# Altium schematic sheet power.SchDoc
size A4
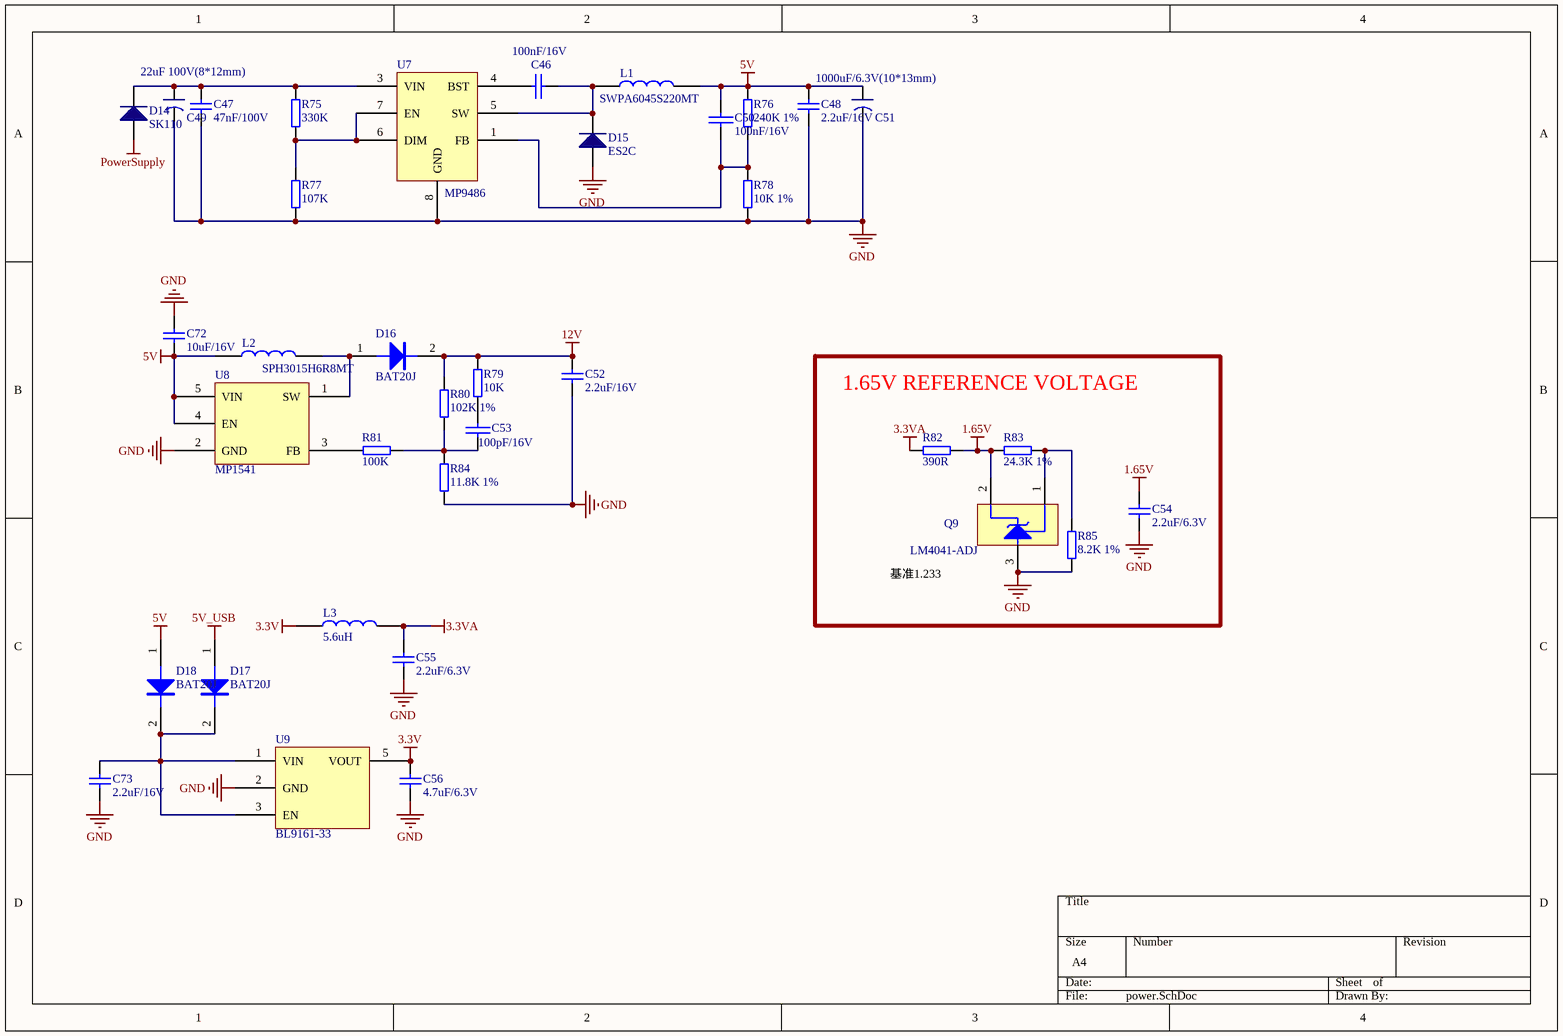
[diagram p0: power.SchDoc]

## Parts
C46  100nF/16V  [C0402]
C47  47nF/100V  [C1206]
C48  2.2uF/16V  [C0603]
C49  22uF 100V(8*12mm)  [AL-ELEC 8*12mm]
C50  100nF/16V  [C0402]
C51  1000uF/6.3V(10*13mm)  [AL-ELEC 10*13mm]
C52  2.2uF/16V  [C0603]
C53  100pF/16V  [C0402]
C54  2.2uF/6.3V  [C0402]
C55  2.2uF/6.3V  [C0402]
C56  4.7uF/6.3V  [C0603]
C72  10uF/16V  [C0805]
C73  2.2uF/16V  [C0603]
D14  SK110  [DO-214AC SMA]
D15  ES2C  [DO-214AA SMB]
D16  BAT20J  [SOD-323]
D17  BAT20J  [SOD-323]
D18  BAT20J  [SOD-323]
L1  SWPA6045S220MT  [SWPA6045S]
L2  SPH3015H6R8MT  [SPH3015]
L3  5.6uH  [L0402]
Q9  LM4041-ADJ  [SOT-23]
R75  330K  [R0402]
R76  240K 1%  [R0402]
R77  107K  [R0402]
R78  10K 1%  [R0402]
R79  10K  [R0402]
R80  102K 1%  [R0402]
R81  100K  [R0402]
R82  390R  [R0603]
R83  24.3K 1%  [R0402]
R84  11.8K 1%  [R0402]
R85  8.2K 1%  [R0402]
U7  MP9486  [SOIC-8 EP]
U8  MP1541  [SOT-23(5)]
U9  BL9161-33  [SOT-23(5)]

## Blocks framed on the sheet
1.65V REFERENCE VOLTAGE: C54 Q9 R82 R83 R85

## Nets
1.65V: C54.2 Q9.2 R82.2 R83.1
3.3V: C56.2 L3.1 U9.5(VOUT)
3.3VA: C55.2 L3.2 R82.1
5V: C48.2 C50.1 C51.1 C72.1 D18.1(A) L1.2 L2.1 R76.1 U8.4(EN) U8.5(VIN)
5V_USB: D17.1(A)
12V: C52.2 D16.2(K) R79.1 R80.1
GND: C47.1 C48.1 C49.2 C51.2 C52.1 C54.1 C55.1 C56.1 C72.2 C73.1 D15.1 Q9.3 R77.2 R78.2 R84.2 R85.2 U7.8(GND) U8.2(GND) U9.2(GND)
PowerSupply: D14.1
NetC46_1: C46.1 D15.2 L1.1 U7.5(SW)
NetC46_2: C46.2 U7.4(BST)
NetC47_2: C47.2 C49.1 D14.2 R75.1 U7.3(VIN)
NetC50_2: C50.2 R76.2 R78.1 U7.1(FB)
NetC53_1: C53.1 R80.2 R81.2 R84.1
NetC53_2: C53.2 R79.2
NetC73_2: C73.2 D17.2(K) D18.2(K) U9.1(VIN) U9.3(EN)
NetD16_1: D16.1(A) L2.2 U8.1(SW)
NetQ9_1: Q9.1 R83.2 R85.1
NetR75_2: R75.2 R77.1 U7.6(DIM) U7.7(EN)
NetR81_1: R81.1 U8.3(FB)

## Notes on the sheet
- (near Q9) 基准1.233

## Library data of the parts
C46 C50 C53 = CAP: Capacitor
C47 C48 C52 C54-C56 C72 C73 = cap
C49 C51 = Capacitor: 铝电解电容
D14 D15 = Diode
D16-D18 = DIODE
L1 = INDUCTOR: 顺络 22uH
L2 = INDUCTOR: 顺络 6.8uH
L3 = INDUCTOR: 贴片电感
Q9 = 3CCCCCC
R75-R85 = Resistance
U9 = BL9161